# Altium schematic sheet CanConnector.SchDoc
size Letter; Organization: Altium Limited; Address1: L3, 12a Rodborough Rd; Address2: Frenchs Forest; Address3: NSW; Address4: Australia 2086; DocumentNumber: D_7; SheetNumber: 7; SheetTotal: 21
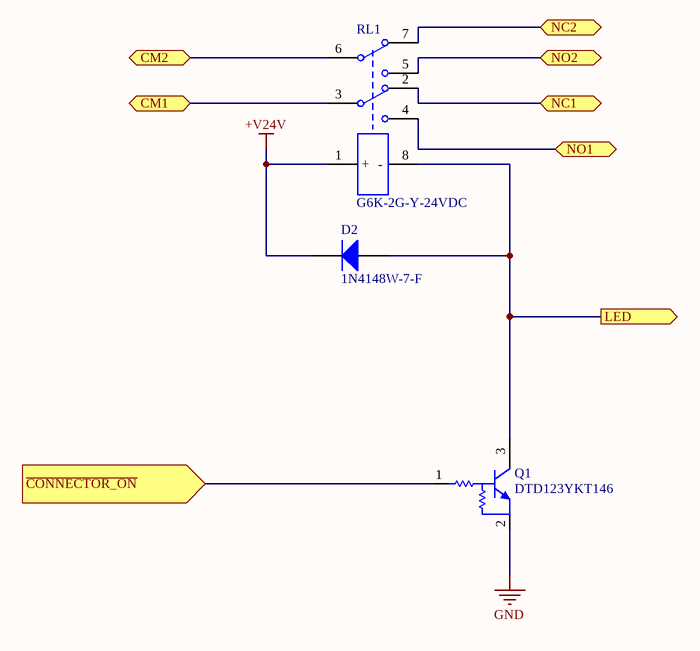
[diagram p0: CanConnector.SchDoc]

## Parts
D2  1N4148W-7-F  [DIOD-SOD123-2_V]
Q1  DTD123YKT146  [SOT95P280X130-3N]
RL1  G6K-2G-Y-24VDC  [G6K-2F-Y]

## Ports
CM1 (bidir), CM2 (bidir), LED (out), NC1 (bidir), NC2 (bidir), NO1 (bidir), NO2 (bidir), ~{CONNECTOR_ON} (in)

## Nets
+V24V: D2.2(K) RL1.1(+)
GND: Q1.2(E)
~{CONNECTOR_ON}: Q1.1(B) ; port ~{CONNECTOR_ON}
CM1: RL1.3 ; port CM1
CM2: RL1.6 ; port CM2
LED: D2.1(A) Q1.3(C) RL1.8(-) ; port LED
NC1: RL1.2 ; port NC1
NC2: RL1.7 ; port NC2
NO1: RL1.4 ; port NO1
NO2: RL1.5 ; port NO2

## Notes on the sheet
- Title
- Size:
- Date:
- Letter
- Number:
- Time:
- Revision:
- Sheet
- of
- Fluid Power Training
- Institute Inc.
- 2170 S 3040 W
- Salt Lake City, 84119,UT.
- United States.
- File:

## Library data of the parts
D2 = 1N4148W-7-F: DIODE GEN PURP 100V 300MA SOD123; Manufacturer: Diodes; Reverse Recovery Time: 4ns; Forward Voltage: 1.25V; Element Configuration: Single; Forward Current: 150mA; Peak Non-Repetitive Surge Current: 2A; Power Dissipation: 400mW; Peak Reverse Current: 1uA; Polarity: Standard; Voltage Rating (DC): 75V; Capacitance: 2pF; Current: 15A; Supplier 1: Mouser; Supplier Part Number 1: 621-1N4148W-F; Manufacturer Part Number: 1N4148W-7-F; RoHS: Yes; Category: Rectifier Diodes; Stock 1: 1274151; Pricing 1: 1=0.16000, 10=0.15000, 100=0.05300, 1000=0.03500, 3000=0.02700, 9000=0.02400 (USD); Mount: Surface Mount; Number of Pins: 2; Weight: 0.000353oz; Contact Plating: Tin,Matte; Min Operating Temperature: -65°C; Max Operating Temperature: 150°C; Packaging: Tape and Reel; Max Repetitive Reverse Voltage (Vrrm): 100V; Package Quantity: 3000; Average Rectified Current: 300mA; Max Reverse Voltage (DC): 100V; Recovery Time: 4ns; Max Forward Surge Current (Ifsm): 2A; Max Surge Current: 2A; Current Rating: 150mA; Output Current: 150mA; Voltage: 100V; Power Rating: 400mW; Length: 2.85mm; Height: 1.25mm; Width: 1.7mm; Radiation Hardening: No; Lead Free: Lead Free; REACH SVHC: No SVHC; ComponentLink1URL: https://datasheet.ciiva.com/4435/ds30086-4435128.pdf?src-supplier=Mouser; ComponentLink1Description: https://datasheet.ciiva.com/4435/ds30086-4435128.pdf?src-supplier=Mouser; ComponentLink2URL: https://datasheet.ciiva.com/8300/ds30086-8300392.pdf?src-supplier=Avnet; ComponentLink2Description: https://datasheet.ciiva.com/8300/ds30086-8300392.pdf?src-supplier=Avnet; ComponentLink3URL: https://datasheet.ciiva.com/911/ds30086-911734.pdf?src-supplier=Digi-Key; ComponentLink3Description: https://datasheet.ciiva.com/911/ds30086-911734.pdf?src-supplier=Digi-Key; ComponentLink4URL: https://datasheet.ciiva.com/911/ds30086-911735.pdf?src-supplier=Digi-Key; ComponentLink4Description: https://datasheet.ciiva.com/911/ds30086-911735.pdf?src-supplier=Digi-Key; ComponentLink5URL: https://datasheet.ciiva.com/22695/1915529-22695239.pdf?src-supplier=Element14; ComponentLink5Description: https://datasheet.ciiva.com/22695/1915529-22695239.pdf?src-supplier=Element14; ComponentLink6URL: https://datasheet.ciiva.com/911/ds30086-911736.pdf?src-supplier=Digi-Key; ComponentLink6Description: https://datasheet.ciiva.com/911/ds30086-911736.pdf?src-supplier=Digi-Key; ComponentLink7URL: https://datasheet.ciiva.com/1179/1915529-1179304.pdf?src-supplier=Element14; ComponentLink7Description: https://datasheet.ciiva.com/1179/1915529-1179304.pdf?src-supplier=Element14; ComponentLink8URL: https://datasheet.ciiva.com/25919/ds30086-25919609.pdf?src-supplier=Avnet+Europe; ComponentLink8Description: https://datasheet.ciiva.com/25919/ds30086-25919609.pdf?src-supplier=Avnet+Europe; ComponentLink9URL: https://datasheet.ciiva.com/15219/getdatasheetpartid-110030-15219548.pdf?src-supplier=Verical; ComponentLink9Description: https://datasheet.ciiva.com/15219/getdatasheetpartid-110030-15219548.pdf?src-supplier=Verical; ComponentLink10URL: https://datasheet.ciiva.com/8303/ds30086-8303197.pdf?src-supplier=Avnet; ComponentLink10Description: https://datasheet.ciiva.com/8303/ds30086-8303197.pdf?src-supplier=Avnet
Q1 = DTD123YKT146: TRANS PREBIAS NPN 200MW SMT3; Manufacturer: Rohm; Collector Emitter Voltage (VCEO): 300mV; Element Configuration: Single; hFE Min: 56; Max Collector Current: 500mA; Collector Emitter Breakdown Voltage: 50V; Transition Frequency: 200MHz; Supplier 1: Mouser; Supplier Part Number 1: 755-DTD123YKT146; Manufacturer Part Number: DTD123YKT146; RoHS: Yes; Category: BJTs; Stock 1: 8666; Pricing 1: 1=0.38000, 10=0.28800, 100=0.15600, 1000=0.11700, 3000=0.10100, 9000=0.09500 (USD); Mount: Surface Mount; Case/Package: SMD/SMT; Number of Pins: 3; Min Operating Temperature: -55°C; Max Operating Temperature: 150°C; Packaging: Tape and Reel; Package Quantity: 1; Max Power Dissipation: 200mW; Polarity: NPN; Power Dissipation: 200mW; Max Breakdown Voltage: 50V; Voltage Rating (DC): 50V; Current Rating: 500mA; Termination: SMD/SMT; Max Output Current: 500mA; Operating Supply Voltage: 50V; Continuous Collector Current: 500mA; Length: 2.9mm; Height: 1.1mm; Width: 1.6mm; Radiation Hardening: No; REACH SVHC: No SVHC; Lead Free: Lead Free; ComponentLink1URL: https://datasheet.ciiva.com/6356/dtd123yk-6356016.pdf?src-supplier=Digi-Key; ComponentLink1Description: https://datasheet.ciiva.com/6356/dtd123yk-6356016.pdf?src-supplier=Digi-Key; ComponentLink2URL: https://datasheet.ciiva.com/16616/dtd123yk-16616256.pdf?src-supplier=Avnet+Europe; ComponentLink2Description: https://datasheet.ciiva.com/16616/dtd123yk-16616256.pdf?src-supplier=Avnet+Europe; ComponentLink3URL: https://datasheet.ciiva.com/5782/1645233-5782035.pdf?src-supplier=Farnell; ComponentLink3Description: https://datasheet.ciiva.com/5782/1645233-5782035.pdf?src-supplier=Farnell; ComponentLink4URL: https://datasheet.ciiva.com/16953/0900766b8101ddb2-16953270.pdf?src-supplier=Allied+Electronics; ComponentLink4Description: https://datasheet.ciiva.com/16953/0900766b8101ddb2-16953270.pdf?src-supplier=Allied+Electronics; ComponentLink5URL: https://datasheet.ciiva.com/12316/dtd123yk-210516-12316106.pdf?src-supplier=Mouser; ComponentLink5Description: https://datasheet.ciiva.com/12316/dtd123yk-210516-12316106.pdf?src-supplier=Mouser; ComponentLink6URL: https://datasheet.ciiva.com/8029/1645233-8029419.pdf?src-supplier=Element14; ComponentLink6Description: https://datasheet.ciiva.com/8029/1645233-8029419.pdf?src-supplier=Element14; ComponentLink7URL: https://datasheet.ciiva.com/11210/dtd123yk-11210380.pdf?src-supplier=Avnet; ComponentLink7Description: https://datasheet.ciiva.com/11210/dtd123yk-11210380.pdf?src-supplier=Avnet
RL1 = G6K-2G-Y-24VDC: Electromechanical Relay DPDT 1A 24VDC 5.22KOhm Surface Mount; Manufacturer: Omron; Manufacturer Part Number: G6K-2F-YDC24; Coil Current: 4.6mA; Coil Resistance: 5.22kR; Coil Voltage (DC): 24V; Max Voltage Rating (AC): 125V; Max Voltage Rating (DC): 60V; Operate Time: 3ms; Coil Type: Non-Latching; Relay Type: Telecom; Coil Power: 100mW; Supplier 1: Mouser; Supplier Part Number 1: 653-G6K-2F-Y-DC24; RoHS: Yes; Category: Signal Relays; Mount: Surface Mount; Number of Pins: 8; Weight: 0.024692oz; Contact Material: Gold,Silver; Min Operating Temperature: -40°C; Max Operating Temperature: 70°C; Packaging: Rail/Tube; Throw Configuration: DPDT; Max Current Rating: 1A; Contact Current Rating: 1A; Termination: Gull Wing; Package Quantity: 50; Release Time: 3ms; Power Consumption: 100mW; Voltage Rating (AC): 125V; Voltage Rating (DC): 60V; Length: 10mm; Depth: 7.8mm; Radiation Hardening: No; Lead Free: Lead Free; ComponentLink1URL: https://datasheet.ciiva.com/30066/81en-g6k-30066045.pdf?src-supplier=Onlinecomponents.com; ComponentLink1Description: https://datasheet.ciiva.com/30066/81en-g6k-30066045.pdf?src-supplier=Onlinecomponents.com